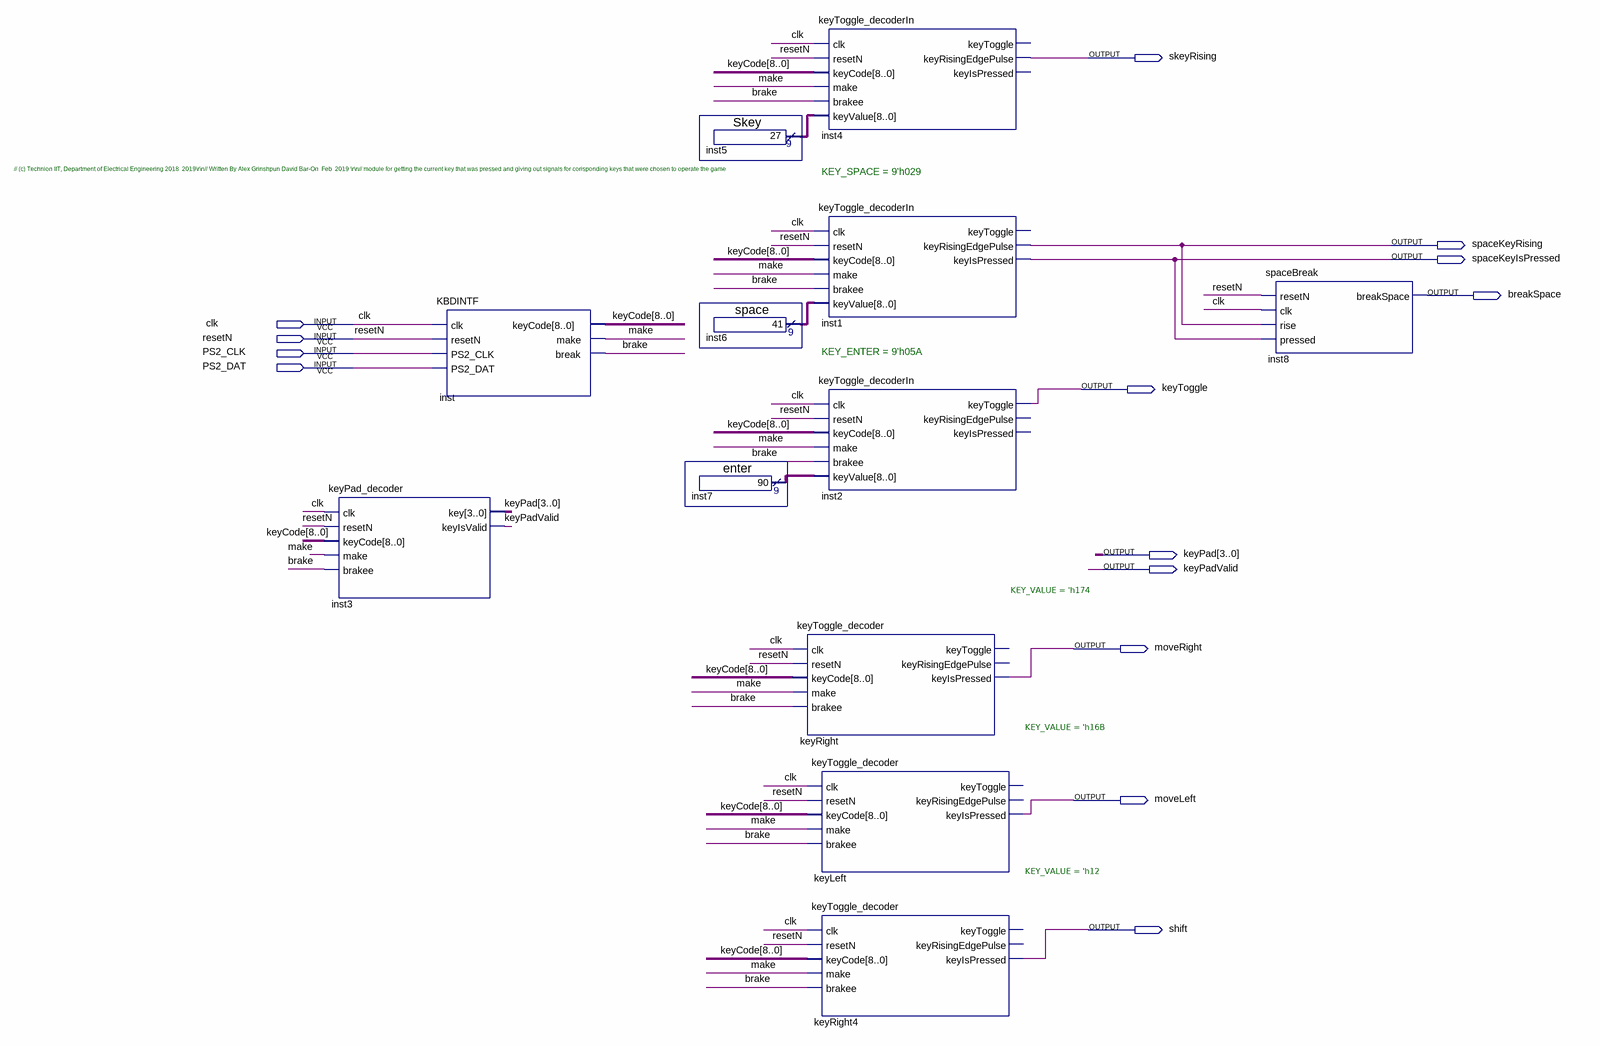
[diagram p0: schematic sheet]
// Quartus schematic TOP_KBD_DEMOALL.bdf as structural Verilog: 12 symbols, 14 pins
module TOP_KBD_DEMOALL (
  input  clk,
  input  resetN,
  input  PS2_CLK,
  input  PS2_DAT,
  output skeyRising,
  output spaceKeyRising,
  output spaceKeyIsPressed,
  output breakSpace,
  output keyToggle,
  output [3:0] keyPad,
  output keyPadValid,
  output moveRight,
  output moveLeft,
  output shift
);

  wire brake, make;
  wire [8:0] inst5_result, inst6_result, inst7_result, keyCode;

  keyPad_decoder inst3 (
    .clk(clk), .resetN(resetN), .keyCode(keyCode), .make(make), .brakee(brake), .key(keyPad),
    .keyIsValid(keyPadValid));
  KBDINTF inst (
    .clk(clk), .resetN(resetN), .PS2_CLK(PS2_CLK), .PS2_DAT(PS2_DAT), .keyCode(keyCode), .make(make),
    .\break (brake));
  Skey inst5 (.result(inst5_result));
  space inst6 (.result(inst6_result));
  enter inst7 (.result(inst7_result));
  keyToggle_decoderIn inst4 (
    .clk(clk), .resetN(resetN), .keyCode(keyCode), .make(make), .brakee(brake), .keyValue(inst5_result),
    .keyRisingEdgePulse(skeyRising));  // open: keyToggle, keyIsPressed
  keyToggle_decoderIn inst1 (
    .clk(clk), .resetN(resetN), .keyCode(keyCode), .make(make), .brakee(brake), .keyValue(inst6_result),
    .keyRisingEdgePulse(spaceKeyRising), .keyIsPressed(spaceKeyIsPressed));  // open: keyToggle
  keyToggle_decoderIn inst2 (
    .clk(clk), .resetN(resetN), .keyCode(keyCode), .make(make), .brakee(brake), .keyValue(inst7_result),
    .keyToggle(keyToggle));  // open: keyRisingEdgePulse, keyIsPressed
  keyToggle_decoder #(.KEY_VALUE('h174)) keyRight (
    .clk(clk), .resetN(resetN), .keyCode(keyCode), .make(make), .brakee(brake), .keyIsPressed(moveRight));  // open: keyToggle, keyRisingEdgePulse
  keyToggle_decoder #(.KEY_VALUE('h16B)) keyLeft (
    .clk(clk), .resetN(resetN), .keyCode(keyCode), .make(make), .brakee(brake), .keyIsPressed(moveLeft));  // open: keyToggle, keyRisingEdgePulse
  keyToggle_decoder #(.KEY_VALUE('h12)) keyRight4 (
    .clk(clk), .resetN(resetN), .keyCode(keyCode), .make(make), .brakee(brake), .keyIsPressed(shift));  // open: keyToggle, keyRisingEdgePulse
  spaceBreak inst8 (
    .resetN(resetN), .clk(clk), .rise(spaceKeyRising), .pressed(spaceKeyIsPressed), .breakSpace(breakSpace));

  // Notes on the sheet:
  //   // (c) Technion IIT, Department of Electrical Engineering 2018  2019\r\n// Written By Alex Grinshpun David Bar-On  Feb  2019 \r\n// module for getting the current key that was pressed and giving out signals for corisponding keys that were chosen to operate the game
  //   KEY_SPACE = 9'h029
  //   KEY_ENTER = 9'h05A
endmodule
